# EAGLE schematic SARA-U290 (EAGLE 6.5.0)
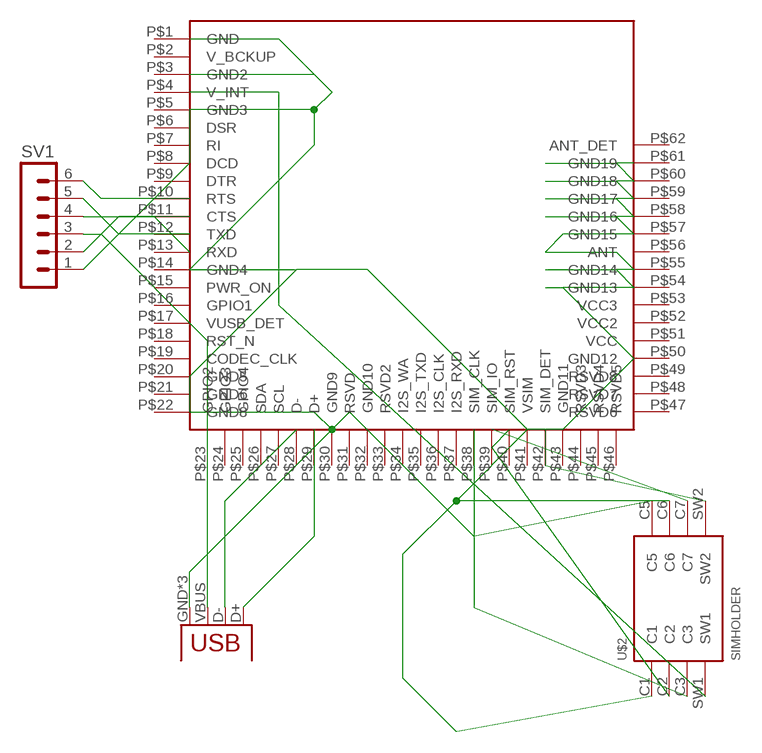
[diagram p0: schematic, sheet 1]

## Parts
JP1  USB-MICROB  [USB-MICROB]
SV1  MA06-1  [MA06-1]
U$1  SARA-U290  [SARA-U290]
U$2  SIMHOLDER  [SIMHOLDER]

## Nets
N$1: U$2.C1 U$2.C6
N$2: U$2.C2
N$3: U$2.C3
N$5: U$2.C7
N$6: U$2.SW2
N$7: U$2.SW1
N$9: JP1.D-
N$10: JP1.D+
N$11: SV1.4
N$12: JP1.GND JP1.MT1(GND) JP1.MT2(GND) SV1.1 U$2.C5
N$13: SV1.2
N$14: SV1.5
N$15: JP1.VBUS SV1.3
N$16: SV1.6
Unconnected: U$1.P$1(GND) U$1.P$2(V_BCKUP) U$1.P$3(GND2) U$1.P$4(V_INT) U$1.P$5(GND3) U$1.P$6(DSR) U$1.P$7(RI) U$1.P$8(DCD) U$1.P$9(DTR) U$1.P$10(RTS) U$1.P$11(CTS) U$1.P$12(TXD) U$1.P$13(RXD) U$1.P$14(GND4) U$1.P$15(PWR_ON) U$1.P$16(GPIO1) U$1.P$17(VUSB_DET) U$1.P$18(RST_N) U$1.P$19(CODEC_CLK) U$1.P$20(GND5) U$1.P$21(GND6) U$1.P$22(GND8) U$1.P$23(GPIO2) U$1.P$24(GPIO3) U$1.P$25(GPIO4) U$1.P$26(SDA) U$1.P$27(SCL) U$1.P$28(D-) U$1.P$29(D+) U$1.P$30(GND9) U$1.P$31(RSVD) U$1.P$32(GND10) U$1.P$33(RSVD2) U$1.P$34(I2S_WA) U$1.P$35(I2S_TXD) U$1.P$36(I2S_CLK) U$1.P$37(I2S_RXD) U$1.P$38(SIM_CLK) U$1.P$39(SIM_IO) U$1.P$40(SIM_RST) U$1.P$41(VSIM) U$1.P$42(SIM_DET) U$1.P$43(GND11) U$1.P$44(RSVD3) U$1.P$45(RSVD4) U$1.P$46(RSVD5) U$1.P$47(RSVD6) U$1.P$48(RSVD7) U$1.P$49(RSVD8) U$1.P$50(GND12) U$1.P$51(VCC) U$1.P$52(VCC2) U$1.P$53(VCC3) U$1.P$54(GND13) U$1.P$55(GND14) U$1.P$56(ANT) U$1.P$57(GND15) U$1.P$58(GND16) U$1.P$59(GND17) U$1.P$60(GND18) U$1.P$61(GND19) U$1.P$62(ANT_DET)

## Library data of the parts
JP1 = SparkFun-Connectors:USB: USB Connectors USB-B-PTH is fully proven SKU : PRT-00139/CONN-08278 USB-miniB is fully proven SKU : PRT-00587 USB-A-PCB is untested. USB-A-H is throughly reviewed, but untested. Spark Fun Electronics SKU : PRT-00437 USB-B-SMT is throughly reviewed, but untested. Needs silkscreen touching up. USB-A-S has not been used/tested USB-MB-H has not been used/tested USB-MICROB has been used. CONN-09505; PROD_ID: CONN-09505
SV1 = con-lstb:MA06-1: PIN HEADER; OC_FARNELL: unknown; OC_NEWARK: unknown
U$1 = SARA-U290:SARA-U290
U$2 = SparkFun-Connectors:SIMHOLDER: SIM Socket Socket for SIM cellular cards. Schematic element and footprint production proven. Spark Fun Electronics SKU : PRT-00548